# Altium schematic sheet Sheet_V1.2_2022-10-07.schdoc
size 410 x 270 mm
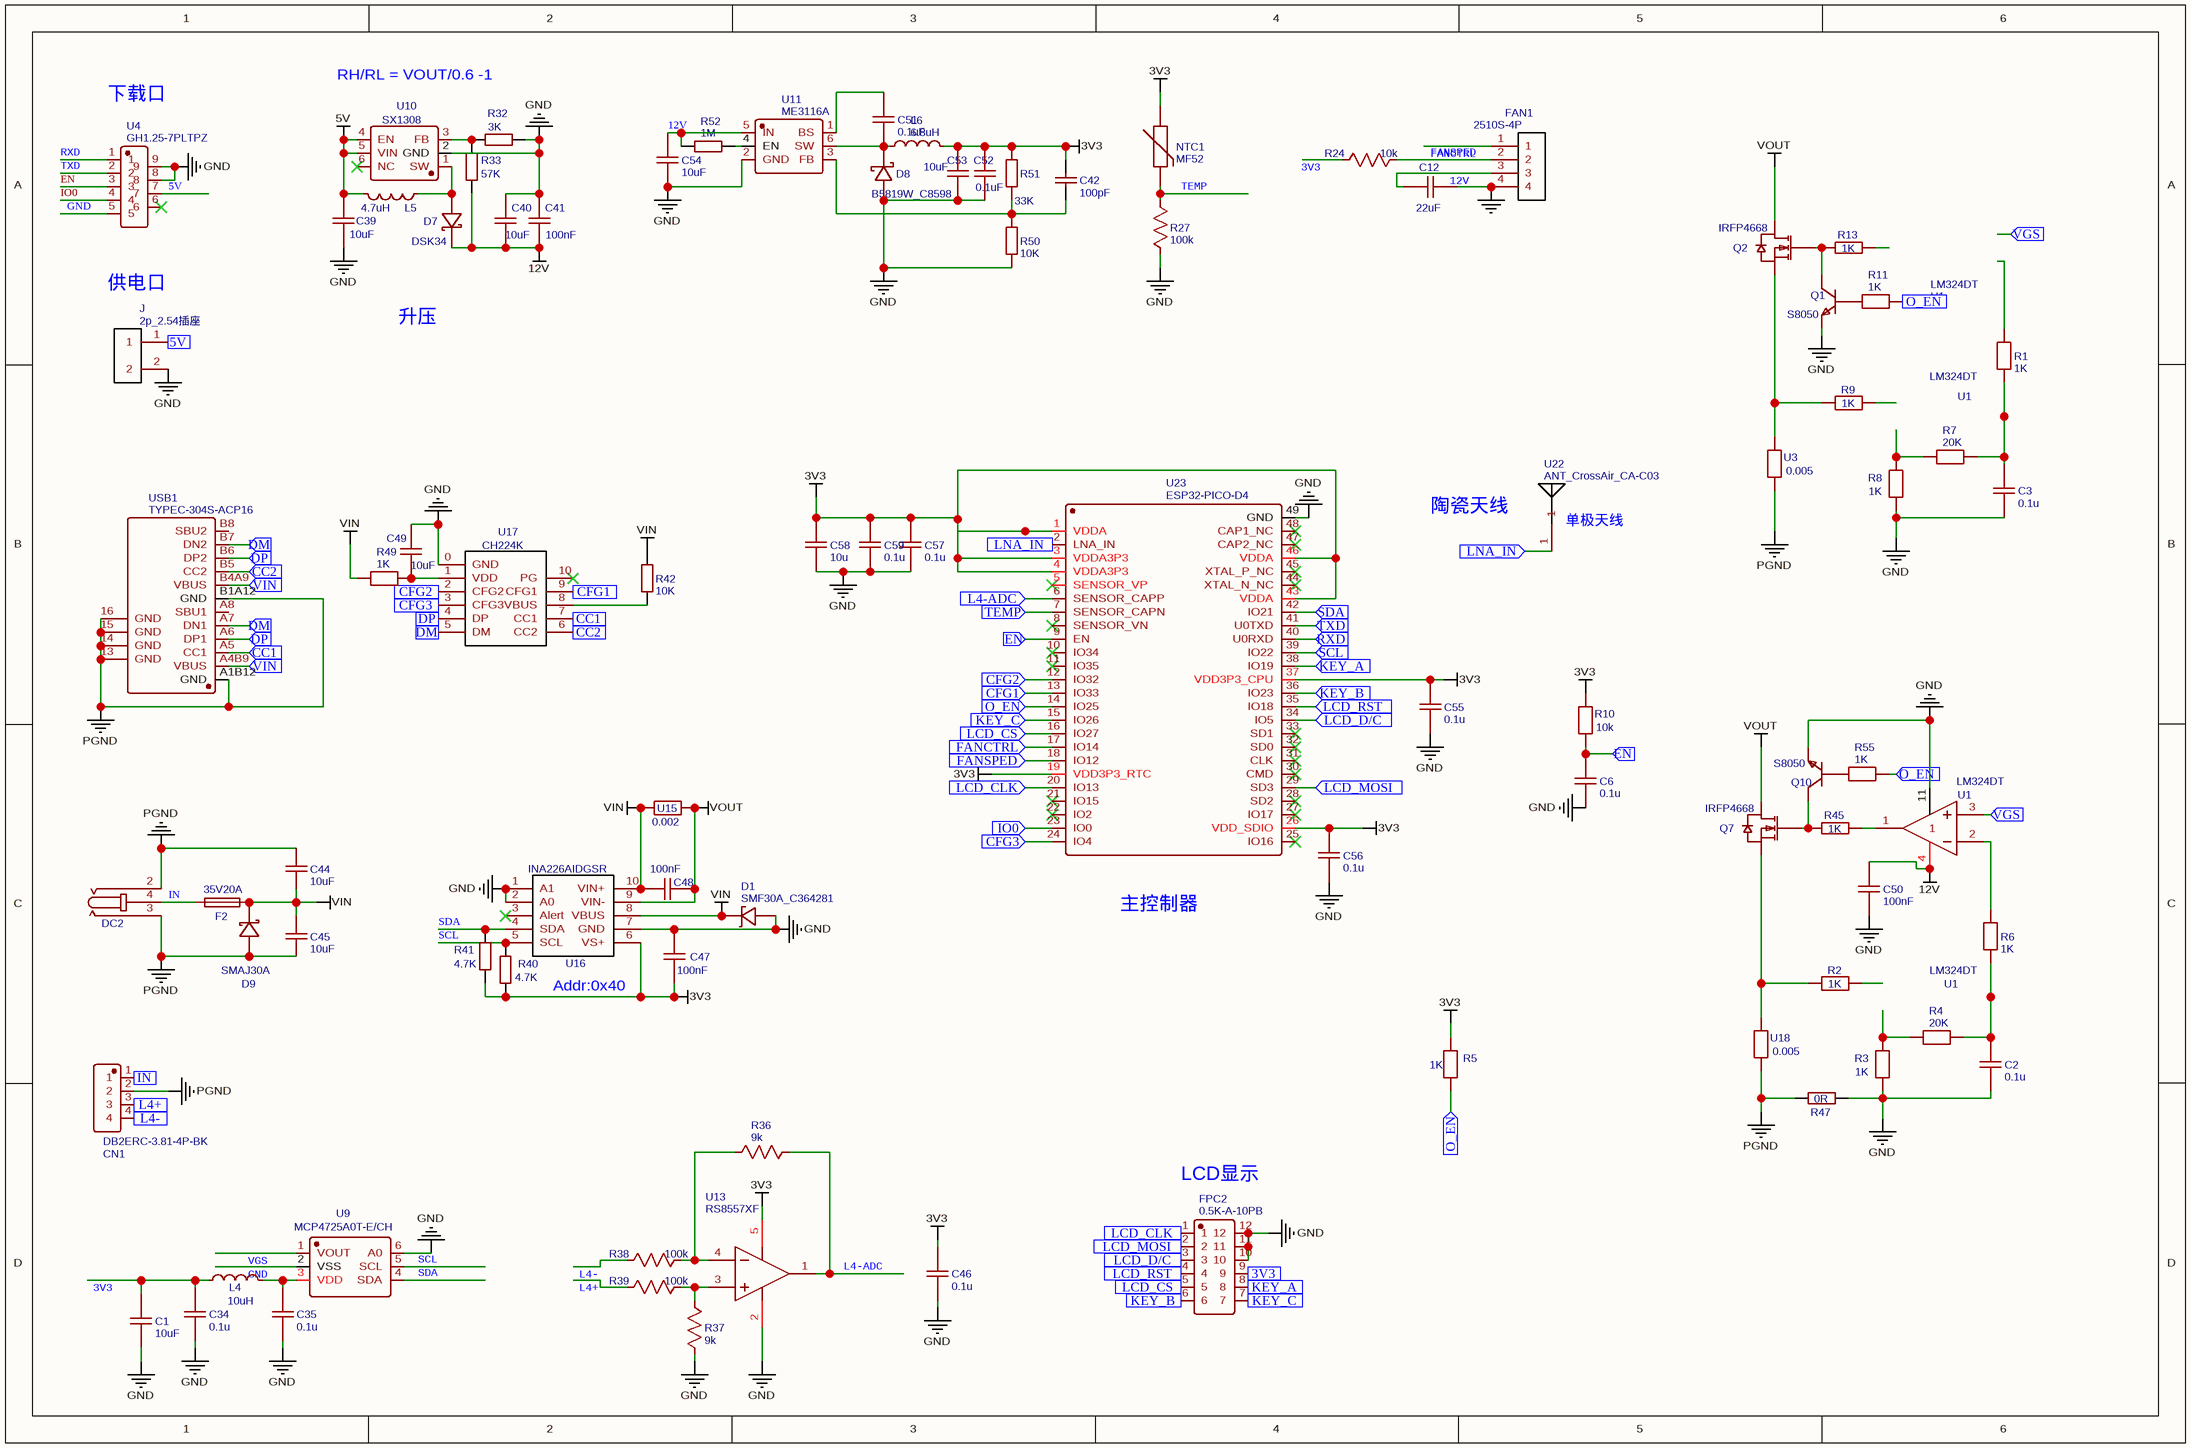
[diagram p0: Sheet_V1.2_2022-10-07.schdoc]

## Parts
(Parts that share a designator on the sheet are numbered #1, #2 ... from top to bottom, then left to right.)
C1  10uF  [C0603]
C2  0.1u  [C0402]
C3  0.1u  [C0402]
C6  0.1u  [C0402]
C12  22uF  [C0805]
C34  0.1u  [C0402]
C35  0.1u  [C0805]
C39  10uF  [C0603]
C40  10uF  [C0603]
C41  100nF  [C0603]
C42  100pF  [C0402]
C44  10uF  [C1206]
C45  10uF  [C1206]
C46  0.1u  [C0603]
C47  100nF  [C0603]
C48  100nF  [C0603]
C49  10uF  [C0603]
C50  100nF  [C0603]
C51  0.1uF  [C0402]
C52  0.1uF  [C0402]
C53  10uF  [C0603]
C54  10uF  [C0603]
C55  0.1u  [C0402]
C56  0.1u  [C0402]
C57  0.1u  [C0402]
C58  10u  [C0402]
C59  0.1u  [C0402]
CN1  DB2ERC-3.81-4P-BK  [CONN-TH_4P-P3.81_DB2ERC-3.81-4P-BK]
D1  SMF30A_C364281  [SOD-123FL_L2.6-W1.6-LS3.4-R-FD]
D7  DSK34  [SOD-123_L2.8-W1.8-LS3.9-FD]
D8  B5819W_C8598  [SOD-123_L2.7-W1.6-LS3.7-RD-1]
D9  SMAJ30A  [SMA_L4.4-W2.8-LS5.4-R-RD]
DC2  DC-042C-W-2.0  [DC-IN-TH_DC-042C-W-2.0]  (value not drawn)
F2  35V20A  [F1206]
FAN1  2510S-4P  [CONN-TH_4P-P2.54_A2510S-4P]
FPC2  0.5K-A-10PB  [CONN-SMD_0.5K-A-10PB]
J  2p_2.54插座  [DIP-2PIN-2.54-RECT-2.54X2.54-E]
L4  10uH  [L0805]
L5  4.7uH  [IND-SMD_L7.0-W6.6_FXL0630]
L6  6.8uH  [L1207]
NTC1  MF52  [RES-TH_L2.5-W2.5-P1.70-D0.3]
Q1  S8050  [SOT-23(SOT-23-3)]
Q2  IRFP4668  [卧式TO-247封装]
Q7  IRFP4668  [卧式TO-247封装]
Q10  S8050  [SOT-23(SOT-23-3)]
R1  1K  [R0402]
R2  1K  [R0402]
R3  1K  [R0402]
R4  20K  [R0402]
R5  1K  [R0402]
R6  1K  [R0402]
R7  20K  [R0402]
R8  1K  [R0402]
R9  1K  [R0402]
R10  10k  [R0402]
R11  1K  [R0402]
R13  1K  [R0402]
R24  10k  [R0402]
R27  100k  [R0402]
R32  3K  [R0402]
R33  57K  [R0402]
R36  9k  [R0402]
R37  9k  [R0402]
R38  100k  [R0402]
R39  100k  [R0402]
R40  4.7K  [R0402]
R41  4.7K  [R0402]
R42  10K  [R0603]
R45  1K  [R0402]
R47  0R  [R0603]
R49  1K  [R0402]
R50  10K  [R0402]
R51  33K  [R0402]
R52  1M  [R0402]
R55  1K  [R0402]
U1#1  LM324DT  [SOIC-14_L8.7-W3.9-P1.27-LS6.0-BL]
U1#2  LM324DT  [SOIC-14_L8.7-W3.9-P1.27-LS6.0-BL]
U1#3  LM324DT  [SOIC-14_L8.7-W3.9-P1.27-LS6.0-BL]
U1#4  LM324DT  [SOIC-14_L8.7-W3.9-P1.27-LS6.0-BL]
U3  0.005  [R2512]
U4  GH1.25-7PLTPZ  [CONN-SMD_GH1.25-7PLTPZ]
U9  MCP4725A0T-E/CH  [SOT-23-6_L2.9-W1.6-P0.95-LS2.8-BR]
U10  SX1308  [SOT-23-6_L2.9-W1.6-P0.95-LS2.8-BR]
U11  ME3116A  [ME3116A]
U13  RS8557XF  [SOT-23-5_L3.0-W1.7-P0.95-LS2.8-BR]
U15  0.002  [R2512]
U16  INA226AIDGSR  [INA226-MSOP-10_10P]
U17  CH224K  [ESSOP10-EP]
U18  0.005  [R2512]
U22  ANT_CrossAir_CA-C03  [ANT_CROSSAIR_CA-C03]
U23  ESP32-PICO-D4  [QFN-48_L7.0-W7.0-P0.50-BL-EP5.1]
USB1  TYPEC-304S-ACP16  [USB-C-SMD_TYPEC-304S-ACP16]

## Ports
3V3 (in), 5V (in), CC1 (in), CC2 (in), CFG1 (in), CFG2 (in), CFG3 (in), DM (in), DP (in), EN (in), FANCTRL (in), FANSPED (in), IN (in), IO0 (in), KEY_A (in), KEY_B (in), KEY_C (in), L4+ (in), L4- (in), L4-ADC (in), LCD_CLK (in), LCD_CS (in), LCD_D/C (in), LCD_MOSI (in), LCD_RST (in), LNA_IN (in), O_EN (in), RXD (in), SCL (in), SDA (in), TEMP (in), TXD (in), VGS (in), VIN (in)

## Nets
3V3: C1.2 C34.2 C42.2 C46.2 C47.1 C52.2 C53.2 C55.2 C56.2 C57.2 C58.2 C59.2 L4.1 L6.2 NTC1.2 R5.2 R10.2 R24.2 R40.2 R41.2 R51.2 U13.5(V+) U16.6(VS+) U23.1(VDDA) U23.3(VDDA3P3) U23.4(VDDA3P3) U23.19(VDD3P3_RTC) U23.26(VDD_SDIO) U23.37(VDD3P3_CPU) U23.43(VDDA) U23.46(VDDA)
5V: C39.1 L5.2 U4.7 U10.4(EN) U10.5(VIN)
12V: C12.1 C40.2 C41.2 C50.2 C54.2 D7.2(K) FAN1.3 R33.1 R52.1 U1#3.4(VCC+) U11.5(IN)
GND: C1.1 C2.1 C3.1 C6.1 C12.2 C34.1 C35.1 C39.2 C40.1 C41.1 C46.1 C47.2 C49.2 C50.1 C52.1 C53.1 C54.1 C55.1 C56.1 C57.1 C58.1 C59.1 D1.2(A) D8.2(+) FAN1.4 FPC2.10 FPC2.11 FPC2.12 J.2 Q1.2 Q10.2 R3.1 R8.1 R27.1 R32.1 R37.2 R47.1 R50.1 U1#3.11(VCC-) U4.5 U4.8 U4.9 U9.2(VSS) U9.6(A0) U10.2(GND) U11.2(GND) U13.2(V-) U16.1(A1) U16.2(A0) U16.7(GND) U17.0(GND) U23.49(GND)
PGND: C44.2 C45.1 CN1.2 D9.1(A) DC2.2 DC2.3 R47.2 U3.1 U18.1 USB1.13(GND) USB1.14(GND) USB1.15(GND) USB1.16(GND) USB1.A1B12(GND) USB1.B1A12(GND)
VIN: C44.1 C45.2 C48.2 D1.1(K) D9.2(K) F2.2 R42.1 R49.1 U15.1 U16.8(VBUS) U16.10(VIN+)
VOUT: C48.1 Q2.2(D) Q7.2(D) U15.2 U16.9(VIN-)
3V3: FPC2.9 ; port 3V3  [a separate net that carries the same name]
5V: J.1 ; port 5V  [a separate net that carries the same name]
CC1: U17.7(CC1) USB1.A5(CC1) ; port CC1
CC2: U17.6(CC2) USB1.B5(CC2) ; port CC2
CFG1: U17.9(CFG1) U23.13(IO33) ; port CFG1
CFG2: U17.2(CFG2) U23.12(IO32) ; port CFG2
CFG3: U17.3(CFG3) U23.24(IO4) ; port CFG3
DM: U17.5(DM) USB1.A7(DN1) USB1.B7(DN2) ; port DM
DP: U17.4(DP) USB1.A6(DP1) USB1.B6(DP2) ; port DP
EN: C6.2 R10.1 U23.9(EN) ; port EN
EN: U4.3  [a separate net that carries the same name]
FANCTRL: U23.17(IO14) ; port FANCTRL
FANCTRL: FAN1.1  [a separate net that carries the same name]
FANSPED: U23.18(IO12) ; port FANSPED
FANSPED: FAN1.2 R24.1  [a separate net that carries the same name]
IN: CN1.1 ; port IN
IN: DC2.4 F2.1  [a separate net that carries the same name]
IO0: U23.23(IO0) ; port IO0
IO0: U4.4  [a separate net that carries the same name]
KEY_A: FPC2.8 U23.38(IO19) ; port KEY_A
KEY_B: FPC2.6 U23.36(IO23) ; port KEY_B
KEY_C: FPC2.7 U23.15(IO26) ; port KEY_C
L4+: CN1.3 ; port L4+
L4+: R39.2  [a separate net that carries the same name]
L4-: CN1.4 ; port L4-
L4-: R38.2  [a separate net that carries the same name]
L4-ADC: R36.2 U13.1(OUT)
L4-ADC: U23.6(SENSOR_CAPP) ; port L4-ADC  [a separate net that carries the same name]
LCD_CLK: FPC2.1 U23.20(IO13) ; port LCD_CLK
LCD_CS: FPC2.5 U23.16(IO27) ; port LCD_CS
LCD_D/C: FPC2.3 U23.34(IO5) ; port LCD_D/C
LCD_MOSI: FPC2.2 U23.29(SD3) ; port LCD_MOSI
LCD_RST: FPC2.4 U23.35(IO18) ; port LCD_RST
LNA_IN: U22.1 U23.2(LNA_IN) ; port LNA_IN
O_EN: R5.1 R11.2 R55.2 U23.14(IO25) ; port O_EN
RXD: U23.40(U0RXD) ; port RXD
RXD: U4.1  [a separate net that carries the same name]
SCL: R40.1 U9.5(SCL) U16.5(SCL)
SCL: U23.39(IO22) ; port SCL  [a separate net that carries the same name]
SDA: R41.1 U9.4(SDA) U16.4(SDA)
SDA: U23.42(IO21) ; port SDA  [a separate net that carries the same name]
TEMP: U23.7(SENSOR_CAPN) ; port TEMP
TEMP: NTC1.1 R27.2  [a separate net that carries the same name]
TXD: U23.41(U0TXD) ; port TXD
TXD: U4.2  [a separate net that carries the same name]
VGS: U9.1(VOUT)
VGS: U1#3.3(IN1+) ; port VGS  [a separate net that carries the same name]
VIN: USB1.A4B9(VBUS) USB1.B4A9(VBUS) ; port VIN  [a separate net that carries the same name]
NetC2_2: C2.2 R4.2 R6.1
NetC3_2: C3.2 R1.1 R7.2
NetC35_2: C35.2 L4.2 U9.3(VDD)
NetC42_1: C42.1 R50.2 R51.1 U11.3(FB)
NetC49_1: C49.1 R49.2 U17.1(VDD)
NetC51_1: C51.1 D8.1(-) L6.1 U11.6(SW)
NetC51_2: C51.2 U11.1(BS)
NetD7_1: D7.1(A) L5.1 U10.1(SW)
NetQ1_1: Q1.1 R11.1
NetQ1_3: Q1.3 Q2.1(G) R13.1
NetQ2_3: Q2.3(S) R9.1 U3.2
NetQ7_1: Q7.1(G) Q10.3 R45.1
NetQ7_3: Q7.3(S) R2.1 U18.2
NetQ10_1: Q10.1 R55.1
NetR3_2: R3.2 R4.1
NetR6_2: R6.2 U1#3.2(IN1-)
NetR7_1: R7.1 R8.2
NetR32_2: R32.2 R33.2 U10.3(FB)
NetR36_1: R36.1 R38.1 U13.4(-IN)
NetR37_1: R37.1 R39.1 U13.3(+IN)
NetR42_2: R42.2 U17.8(VBUS)
NetR45_2: R45.2 U1#3.1(OUT1)
NetR52_2: R52.2 U11.4(EN)

Not connected (* = marked no-connect by the designer): R1 2; R2 2; R9 2; R13 2; U4 6*; U10 6(NC)*; U16 3(Alert)*; U17 10(PG)*; U23 5(SENSOR_VP)* 8(SENSOR_VN)* 10(IO34)* 11(IO35)* 21(IO15)* 22(IO2)* 25(IO16)* 27(IO17)* 28(SD2)* 30(CMD)* 31(CLK)* 32(SD0)* 33(SD1)* 44(XTAL_N_NC)* 45(XTAL_P_NC)* 47(CAP2_NC)* 48(CAP1_NC)*; USB1 A8(SBU1) B8(SBU2)

## Notes on the sheet
- 下载口
- RH/RL = VOUT/0.6 -1
- 供电口
- 升压
- 陶瓷天线
- (near U23) 主控制器
- Addr:0x40
- (near FPC2) LCD显示
- (in symbol ANT_CrossAir_CA-C03) 单极天线

## Library data of the parts
C1 C53 C54 = 10uF: BOM_Manufacturer: KEMET; BOM_Manufacturer Part: C0603C106M9PAC7867; nameAlias: Capacitance; Contributor: LCSC; BOM_Supplier: LCSC; BOM_Supplier Part: C599662; spicePre: C; spiceSymbolName: C0603C106M9PAC7867
C2 C3 C6 C34 C35 C46 C55-C57 C59 = 0.1u: nameAlias: Value(F); Contributor: LCEDA_Lib; spicePre: C
  C2 C3 C6 C55-C57 C59: spiceSymbolName: C_0402_US
  C34 C35 C46: spiceSymbolName: C_0805_US
C12 = 22uF: BOM_Manufacturer: SAMSUNG; BOM_Manufacturer Part: CL21A226MAQNNNE; nameAlias: Capacitance; BOM_Supplier: LCSC; BOM_Supplier Part: C45783; BOM_JLCPCB Part Class: Basic Part; spicePre: C; spiceSymbolName: CL21A226MAQNNNE
C39 C40 C49 = 10uF: BOM_Manufacturer: SAMSUNG; BOM_Manufacturer Part: CL10B104KC8NNNC; nameAlias: Capacitance; SMT Type: Extend; BOM_Supplier: LCSC; BOM_Supplier Part: C18800; BOM_LCSC Assembly: Yes; spicePre: C; spiceSymbolName: CL10B104KC8NNNC
C41 C47 C48 C50 = 100nF: BOM_Manufacturer: SAMSUNG; BOM_Manufacturer Part: CL10B104KC8NNNC; nameAlias: Capacitance; SMT Type: Extend; BOM_Supplier: LCSC; BOM_Supplier Part: C15725; BOM_LCSC Assembly: Yes; spicePre: C; spiceSymbolName: CL10B104KC8NNNC
C42 = 100pF: BOM_Manufacturer: FH; BOM_Manufacturer Part: 0402CG101J500NT; nameAlias: Capacitance; BOM_Supplier: LCSC; BOM_Supplier Part: C1546; BOM_JLCPCB Part Class: Basic Part; spicePre: C; spiceSymbolName: 0402CG101J500NT
C44 C45 = 10uF: BOM_Manufacturer: TDK; BOM_Manufacturer Part: C3216X5R1H106KT000N; nameAlias: Capacitance; Contributor: LCSC; BOM_Supplier: LCSC; BOM_Supplier Part: C329928; spicePre: C; spiceSymbolName: C3216X5R1H106KT000N
C51 C52 = 0.1uF: BOM_Manufacturer: Knowles(楼氏); BOM_Manufacturer Part: 0402BB104K160NGT; nameAlias: Capacitance; Contributor: LCSC; BOM_Supplier: LCSC; BOM_Supplier Part: C2173076; BOM_JLCPCB Part Class: Extended Part; spicePre: C; spiceSymbolName: 0402BB104K160NGT
C58 = 10u: nameAlias: Value(F); Contributor: LCEDA_Lib; spicePre: C; spiceSymbolName: C_0402_US
CN1 = DB2ERC-3.81-4P-BK: BOM_Manufacturer: DIBO(地博电气); Contributor: LCSC; BOM_Supplier: LCSC; BOM_Supplier Part: C2938681; BOM_Manufacturer Part: DB2ERC-3.81-4P-BK; spicePre: C; spiceSymbolName: DB2ERC-3.81-4P-BK
D1 = SMF30A_C364281: BOM_Manufacturer: (MDD) Jiangsu Yutai Elec; BOM_Manufacturer Part: SMF30A; Contributor: LCSC; BOM_Supplier: LCSC; BOM_Supplier Part: C364281; BOM_JLCPCB Part Class: Extended Part; spicePre: D; spiceSymbolName: SMF30A_C364281
D7 = DSK34: BOM_Manufacturer: LGE; Contributor: LCSC; BOM_Supplier: LCSC; BOM_Supplier Part: C713645; BOM_Manufacturer Part: DSK34; BOM_JLCPCB Part Class: Extended Part; spicePre: D; spiceSymbolName: DSK34_C713645
D8 = B5819W_C8598: BOM_Manufacturer: CJ; BOM_Manufacturer Part: B5819W; BOM_Supplier: LCSC; BOM_Supplier Part: C8598; BOM_JLCPCB Part Class: Basic Part; spicePre: D; spiceSymbolName: B5819W_C8598
D9 = SMAJ30A: BOM_Manufacturer: TWGMC; BOM_Manufacturer Part: SMAJ24A; Contributor: LCSC; BOM_Supplier: LCSC; BOM_Supplier Part: C726750; spicePre: D; spiceSymbolName: SMAJ24A_C726750
DC2 = DC-042C-W-2.0: BOM_Manufacturer: XKB Enterprise; Contributor: LCSC; BOM_Supplier: LCSC; BOM_Supplier Part: C381108; BOM_Manufacturer Part: DC-042C-W-2.0; spicePre: D; spiceSymbolName: DC-042C-W-2.0
F2 = 35V20A: BOM_Manufacturer: TA-I Tech; BOM_Manufacturer Part: CFS12V3T7R0; Contributor: LCSC; BOM_Supplier: LCSC; BOM_Supplier Part: C163124; spicePre: F; spiceSymbolName: CFS12V3T7R0
FAN1 = 2510S-4P: BOM_Manufacturer: Shenzhen Cankemeng; Contributor: LCSC; BOM_Supplier: LCSC; BOM_Supplier Part: C140769; BOM_Manufacturer Part: 2510S-4P; spicePre: C; spiceSymbolName: 2510S-4P
FPC2 = 0.5K-A-10PB: BOM_Manufacturer: HDGC(华德共创); Contributor: LCSC; BOM_Supplier: LCSC; BOM_Supplier Part: C2914136; BOM_Manufacturer Part: 0.5K-A-10PB; BOM_JLCPCB Part Class: Extended Part; spicePre: F; spiceSymbolName: 0.5K-A-10PB
J = 2p_2.54插座: Contributor: lcccclcccc; spicePre: U; spiceSymbolName: 2p_2.54插座
L4 = 10uH: BOM_Manufacturer: FH; BOM_Manufacturer Part: CMP201209XD100MT; nameAlias: Inductance; BOM_Supplier: LCSC; BOM_Supplier Part: C139245; spicePre: L; spiceSymbolName: CMP201209XD100MT
L5 = 4.7uH: BOM_Manufacturer: Wenshan; BOM_Manufacturer Part: YT0630-4R7M; nameAlias: Inductance; Contributor: LCSC; BOM_Supplier: LCSC; BOM_Supplier Part: C428416; spicePre: L; spiceSymbolName: YT0630-4R7M
L6 = 6.8uH: BOM_Manufacturer: Taiyo Yuden; BOM_Manufacturer Part: LB3218T6R8M; nameAlias: Inductance; Contributor: LCSC; BOM_Supplier: LCSC; BOM_Supplier Part: C223384; BOM_JLCPCB Part Class: Extended Part; spicePre: L; spiceSymbolName: LB3218T6R8M
NTC1 = MF52: BOM_Manufacturer: Shiheng; BOM_Manufacturer Part: MF52A1104F3950(P209-15A); nameAlias: Value; BOM_Supplier: LCSC; BOM_Supplier Part: C13424; spicePre: R; spiceSymbolName: MF52A1104F3950(P209-15A)
Q1 Q10 = S8050: BOM_Manufacturer: Hottech; Contributor: LCSC; BOM_Supplier: LCSC; BOM_Manufacturer Part: S8050; BOM_Supplier Part: C181158; BOM_LCSC Assembly: Yes; spicePre: Q
Q2 Q7 = IRFP4668: Contributor: FJ956391150; spicePre: Q; spiceSymbolName: IRFP4668
R1-R3 R5 R6 R8 R9 R11 R49 R55 = 1K: BOM_Manufacturer: YAGEO; BOM_Manufacturer Part: AC0402DR-071KL; nameAlias: Resistance (Ohms); Contributor: LCSC; Resistance: 1kΩ; BOM_Supplier: LCSC; BOM_Supplier Part: C226698; BOM_JLCPCB Part Class: Extended Part; spicePre: R; spiceSymbolName: AC0402DR-071KL
R4 R7 = 20K: BOM_Manufacturer: YAGEO; BOM_Manufacturer Part: AC0402DR-071KL; nameAlias: Resistance (Ohms); Contributor: LCSC; Resistance: 1kΩ; BOM_Supplier: LCSC; BOM_Supplier Part: C226698; BOM_JLCPCB Part Class: Extended Part; spicePre: R; spiceSymbolName: AC0402DR-071KL
R10 = 10k: nameAlias: Value(Ω); Contributor: LCEDA_Lib; spicePre: R; spiceSymbolName: R_0402_EU
R13 R45 = 1K: BOM_Manufacturer: Tyohm; BOM_Manufacturer Part: RMC06031K1%N; nameAlias: Resistance (Ohms); Contributor: LCSC; BOM_Supplier: LCSC; BOM_Supplier Part: C269704; BOM_JLCPCB Part Class: Extended Part; spicePre: R; spiceSymbolName: RMC06031K1%N
R24 = 10k: nameAlias: Value(Ω); spicePre: R; spiceSymbolName: Res_0805(1/8W)_US
R27 R38 R39 = 100k: nameAlias: Value(Ω); spicePre: R; spiceSymbolName: Res_0805(1/8W)_US
R32 = 3K: BOM_Manufacturer: UniOhm; BOM_Manufacturer Part: 0603WAJ0000T5E; nameAlias: Resistance (Ohms); BOM_Supplier: LCSC; BOM_Supplier Part: C15402; BOM_JLCPCB Part Class: Extended Part; spicePre: R; spiceSymbolName: 0603WAJ0000T5E
R33 = 57K: BOM_Manufacturer: UniOhm; BOM_Manufacturer Part: 0603WAJ0000T5E; nameAlias: Resistance (Ohms); BOM_Supplier: LCSC; BOM_Supplier Part: C15402; BOM_JLCPCB Part Class: Extended Part; spicePre: R; spiceSymbolName: 0603WAJ0000T5E
R36 R37 = 9k: nameAlias: Value(Ω); spicePre: R; spiceSymbolName: Res_0805(1/8W)_US
R40 R41 = 4.7K: BOM_Manufacturer: UniOhm; BOM_Manufacturer Part: 0603WAJ0000T5E; nameAlias: Resistance (Ohms); BOM_Supplier: LCSC; BOM_Supplier Part: C15402; BOM_JLCPCB Part Class: Extended Part; spicePre: R; spiceSymbolName: 0603WAJ0000T5E
R42 = 10K: BOM_Manufacturer: UniOhm; BOM_Manufacturer Part: 0603WAJ0000T5E; nameAlias: Resistance (Ohms); BOM_Supplier: LCSC; BOM_Supplier Part: C15402; BOM_JLCPCB Part Class: Extended Part; spicePre: R; spiceSymbolName: 0603WAJ0000T5E
R47 = 0R: BOM_Manufacturer: UniOhm; BOM_Manufacturer Part: 0603WAJ0000T5E; nameAlias: Resistance (Ohms); BOM_Supplier: LCSC; BOM_Supplier Part: C15402; BOM_JLCPCB Part Class: Extended Part; spicePre: R; spiceSymbolName: 0603WAJ0000T5E
R50 = 10K: BOM_Manufacturer: Tyohm; BOM_Manufacturer Part: RMC04021.8K1%N; nameAlias: Resistance (Ohms); Contributor: LCSC; BOM_Supplier: LCSC; BOM_Supplier Part: C269396; BOM_JLCPCB Part Class: Extended Part; spicePre: R; spiceSymbolName: RMC04021.8K1%N
R51 = 33K: BOM_Manufacturer: YAGEO; BOM_Manufacturer Part: RT0402DRE0710KL; nameAlias: Resistance (Ohms); Contributor: LCSC; BOM_Supplier: LCSC; BOM_Supplier Part: C326912; BOM_JLCPCB Part Class: Extended Part; spicePre: R; spiceSymbolName: RT0402DRE0710KL
R52 = 1M: BOM_Manufacturer: LIZ; BOM_Manufacturer Part: CR0402FF1004G; nameAlias: Resistance (Ohms); BOM_Supplier: LCSC; BOM_Supplier Part: C100198; BOM_JLCPCB Part Class: Extended Part; spicePre: R; spiceSymbolName: CR0402FF1004G
U1#1-U1#4 = LM324DT: BOM_Manufacturer: STMicroelectronics; subpart_no: 2; SMT Type: Basic; spicePre: X; BOM_Supplier: LCSC; BOM_Manufacturer Part: LM324DT; image: //image.lceda.cn/szlcsc/C71035.jpg; BOM_Supplier Part: C71035; BOM_JLCPCB SMD: Yes; BOM_JLCPCB Part Class: Basic Part; spiceSymbolName: LM324DT
U3 U18 = 0.005: BOM_Manufacturer: yezhan(业展); BOM_Manufacturer Part: ASR-K-3-5F; Contributor: LCSC; BOM_Supplier: LCSC; BOM_Supplier Part: C695816; BOM_JLCPCB Part Class: Extended Part; spicePre: U; spiceSymbolName: ASR-K-3-5F
U4 = GH1.25-7PLTPZ: BOM_Manufacturer: BOOMELE(博穆精密); Contributor: LCSC; BOM_Supplier: LCSC; BOM_Supplier Part: C2829265; BOM_Manufacturer Part: GH1.25-7PLTPZ; BOM_JLCPCB Part Class: Extended Part; spicePre: U; spiceSymbolName: GH1.25-7PLTPZ
U9 = MCP4725A0T-E/CH: BOM_Manufacturer: MICROCHIP; Contributor: LCSC; SMT Type: Extend; BOM_Supplier: LCSC; BOM_Manufacturer Part: MCP4725A0T-E/CH; BOM_Supplier Part: C144198; BOM_LCSC Assembly: Yes; spicePre: U; spiceSymbolName: MCP4725A0T-E/CH
U10 = SX1308: BOM_Manufacturer: SX; sourceId: g4Yg9rJ1j; timeStamp: 1472247539; BOM_Supplier: LCSC; BOM_Manufacturer Part: SX1308; BOM_Supplier Part: C78162; BOM_JLCPCB Part Class: Extended Part; spicePre: U; spiceSymbolName: SX1308
U11 = ME3116A: Contributor: Zjx3315; spicePre: U; spiceSymbolName: ME3116A
U13 = RS8557XF: BOM_Manufacturer: RUNIC(  ); Contributor: LCSC; SMT Type: Extend; BOM_Supplier: LCSC; BOM_Supplier Part: C255424; BOM_Manufacturer Part: RS8557XF; BOM_LCSC Assembly: Yes; spicePre: U; spiceSymbolName: RS8557XF
U15 = 0.002: BOM_Manufacturer: yezhan(业展); BOM_Manufacturer Part: ASR-K-3-5F; Contributor: LCSC; BOM_Supplier: LCSC; BOM_Supplier Part: C695816; BOM_JLCPCB Part Class: Extended Part; spicePre: U; spiceSymbolName: ASR-K-3-5F
U16 = INA226AIDGSR: BOM_Manufacturer: TI; SMT Type: Extend; BOM_Supplier: LCSC; BOM_Manufacturer Part: INA226AIDGSR; image: //image.lceda.cn/szlcsc/C49851.jpg; BOM_Supplier Part: C49851; BOM_LCSC Assembly: Yes; spicePre: U; spiceSymbolName: INA226AIDGSR
U17 = CH224K: BOM_Manufacturer: 南京沁恒微电子; Contributor: hans_1024; spicePre: U; spiceSymbolName: CH224K
U22 = ANT_CrossAir_CA-C03: Contributor: BVREAVE; link: https://item.taobao.com/item.htm?spm=a230r.1.14.4.81c453c0MSMjjx&id=627328734225&ns=1&abbucket=1#detail; spicePre: U; spiceSymbolName: ANT_CrossAir_CA-C03
U23 = ESP32-PICO-D4: BOM_Manufacturer: Espressif Systems; Contributor: LCSC; BOM_Supplier: LCSC; BOM_Supplier Part: C193707; BOM_Manufacturer Part: ESP32-PICO-D4; BOM_JLCPCB Part Class: Extended Part; spicePre: U; spiceSymbolName: ESP32-PICO-D4
USB1 = TYPEC-304S-ACP16: BOM_Manufacturer: XUNPU; Contributor: LCSC; BOM_Supplier: LCSC; BOM_Supplier Part: C720630; BOM_Manufacturer Part: TYPEC-304S-ACP16; BOM_JLCPCB Part Class: Extended Part; spicePre: U; spiceSymbolName: TYPEC-304S-ACP16